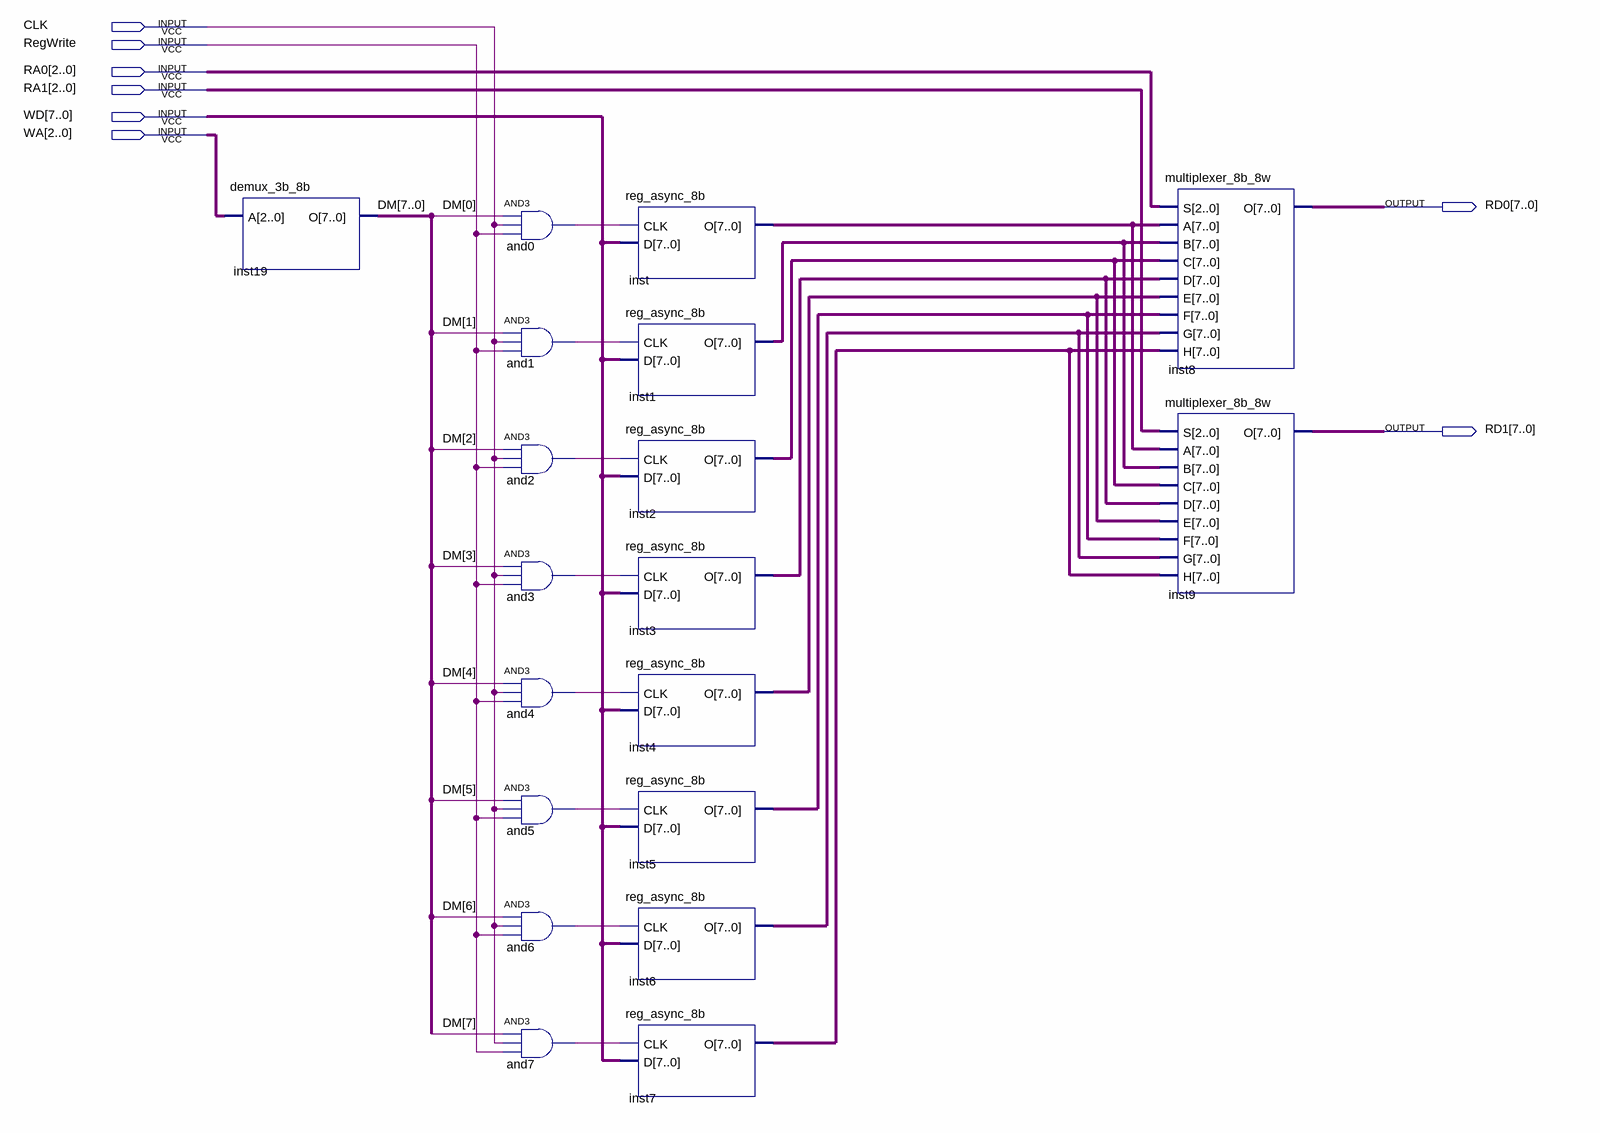
[diagram p0: schematic sheet]
// Quartus schematic reg_file_8x8b.bdf as structural Verilog: 19 symbols, 8 pins
module reg_file_8x8b (
  input  CLK,
  input  RegWrite,
  input  [2:0] RA0,
  input  [2:0] RA1,
  input  [7:0] WD,
  input  [2:0] WA,
  output [7:0] RD0,
  output [7:0] RD1
);

  wire and0_out, and1_out, and2_out, and3_out, and4_out, and5_out, and6_out, and7_out;
  wire [7:0] DM, inst1_o, inst2_o, inst3_o, inst4_o, inst5_o, inst6_o, inst7_o, inst_o;

  demux_3b_8b inst19 (.A(WA), .O(DM));
  and and0 (and0_out, DM[0], CLK, RegWrite);
  and and1 (and1_out, DM[1], CLK, RegWrite);
  and and2 (and2_out, DM[2], CLK, RegWrite);
  and and3 (and3_out, DM[3], CLK, RegWrite);
  and and4 (and4_out, DM[4], CLK, RegWrite);
  and and5 (and5_out, DM[5], CLK, RegWrite);
  and and6 (and6_out, DM[6], CLK, RegWrite);
  and and7 (and7_out, DM[7], CLK, RegWrite);
  reg_async_8b inst (.CLK(and0_out), .D(WD), .O(inst_o));
  reg_async_8b inst1 (.CLK(and1_out), .D(WD), .O(inst1_o));
  reg_async_8b inst2 (.CLK(and2_out), .D(WD), .O(inst2_o));
  reg_async_8b inst3 (.CLK(and3_out), .D(WD), .O(inst3_o));
  reg_async_8b inst4 (.CLK(and4_out), .D(WD), .O(inst4_o));
  reg_async_8b inst5 (.CLK(and5_out), .D(WD), .O(inst5_o));
  reg_async_8b inst6 (.CLK(and6_out), .D(WD), .O(inst6_o));
  reg_async_8b inst7 (.CLK(and7_out), .D(WD), .O(inst7_o));
  multiplexer_8b_8w inst8 (
    .S(RA0), .A(inst_o), .B(inst1_o), .C(inst2_o), .D(inst3_o), .E(inst4_o), .F(inst5_o), .G(inst6_o),
    .H(inst7_o), .O(RD0));
  multiplexer_8b_8w inst9 (
    .S(RA1), .A(inst_o), .B(inst1_o), .C(inst2_o), .D(inst3_o), .E(inst4_o), .F(inst5_o), .G(inst6_o),
    .H(inst7_o), .O(RD1));
endmodule
